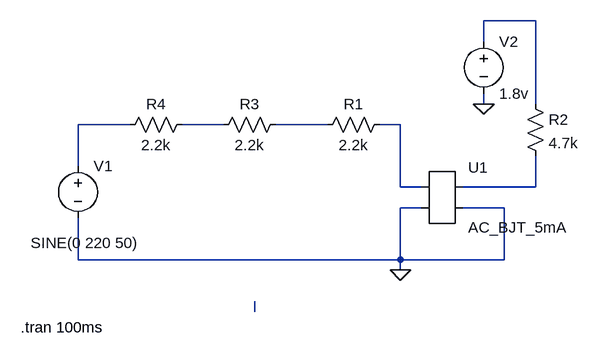
[diagram p0: schematic pc814_zero_crossing.asc]
pc814_zero_crossing.asc, the LTspice schematic file:
Version 4
SHEET 1 1056 680
WIRE 736 -32 656 -32
WIRE 656 0 656 -32
WIRE 656 96 656 80
WIRE 736 96 736 -32
WIRE 112 128 32 128
WIRE 256 128 192 128
WIRE 416 128 336 128
WIRE 528 128 496 128
WIRE 32 192 32 128
WIRE 528 224 528 128
WIRE 560 224 528 224
WIRE 736 224 736 176
WIRE 736 224 624 224
WIRE 560 256 528 256
WIRE 688 256 624 256
WIRE 32 336 32 272
WIRE 528 336 528 256
WIRE 528 336 32 336
WIRE 688 336 688 256
WIRE 688 336 528 336
WIRE 528 352 528 336
WIRE 304 416 304 400
FLAG 528 352 0
FLAG 656 96 0
SYMBOL AutoGenerated\\AC_BJT_5mA 592 240 R0
SYMATTR InstName U1
SYMBOL voltage 32 176 R0
WINDOW 3 -73 134 Left 2
WINDOW 123 0 0 Left 0
WINDOW 39 0 0 Left 0
SYMATTR Value SINE(0 220 50)
SYMATTR InstName V1
SYMBOL res 512 112 R90
WINDOW 0 0 56 VBottom 2
WINDOW 3 32 56 VTop 2
SYMATTR InstName R1
SYMATTR Value 2.2k
SYMBOL res 720 80 R0
SYMATTR InstName R2
SYMATTR Value 4.7k
SYMBOL voltage 656 -16 R0
WINDOW 123 0 0 Left 0
WINDOW 39 0 0 Left 0
SYMATTR InstName V2
SYMATTR Value 1.8v
SYMBOL res 352 112 R90
WINDOW 0 0 56 VBottom 2
WINDOW 3 32 56 VTop 2
SYMATTR InstName R3
SYMATTR Value 2.2k
SYMBOL res 208 112 R90
WINDOW 0 0 56 VBottom 2
WINDOW 3 32 56 VTop 2
SYMATTR InstName R4
SYMATTR Value 2.2k
TEXT -56 440 Left 2 !.tran 100ms

The netlist it stands for:
* pc814_zero_crossing.asc
* U1: AC_BJT_5mA (symbol AutoGenerated\AC_BJT_5mA not available, pins judged from their places): pin1=N005 pin2=0 pin3=N006 pin4=0
V1 N002 0 SINE(0 220 50)
R1 N005 N004 2.2k
R2 N001 N006 4.7k
V2 N001 0 1.8v
R3 N004 N003 2.2k
R4 N003 N002 2.2k
.tran 100ms
.backanno
.end